# Altium schematic sheet [04] - LCD, VGA.SchDoc
size A3; CompanyName: FPT-FTI copporation; Address1: FPT Building Duy Tan; Address2: Floor 4,; DocumentNumber: 4; SheetNumber: 4; SheetTotal: 13; NameAuthor: Angle Vu
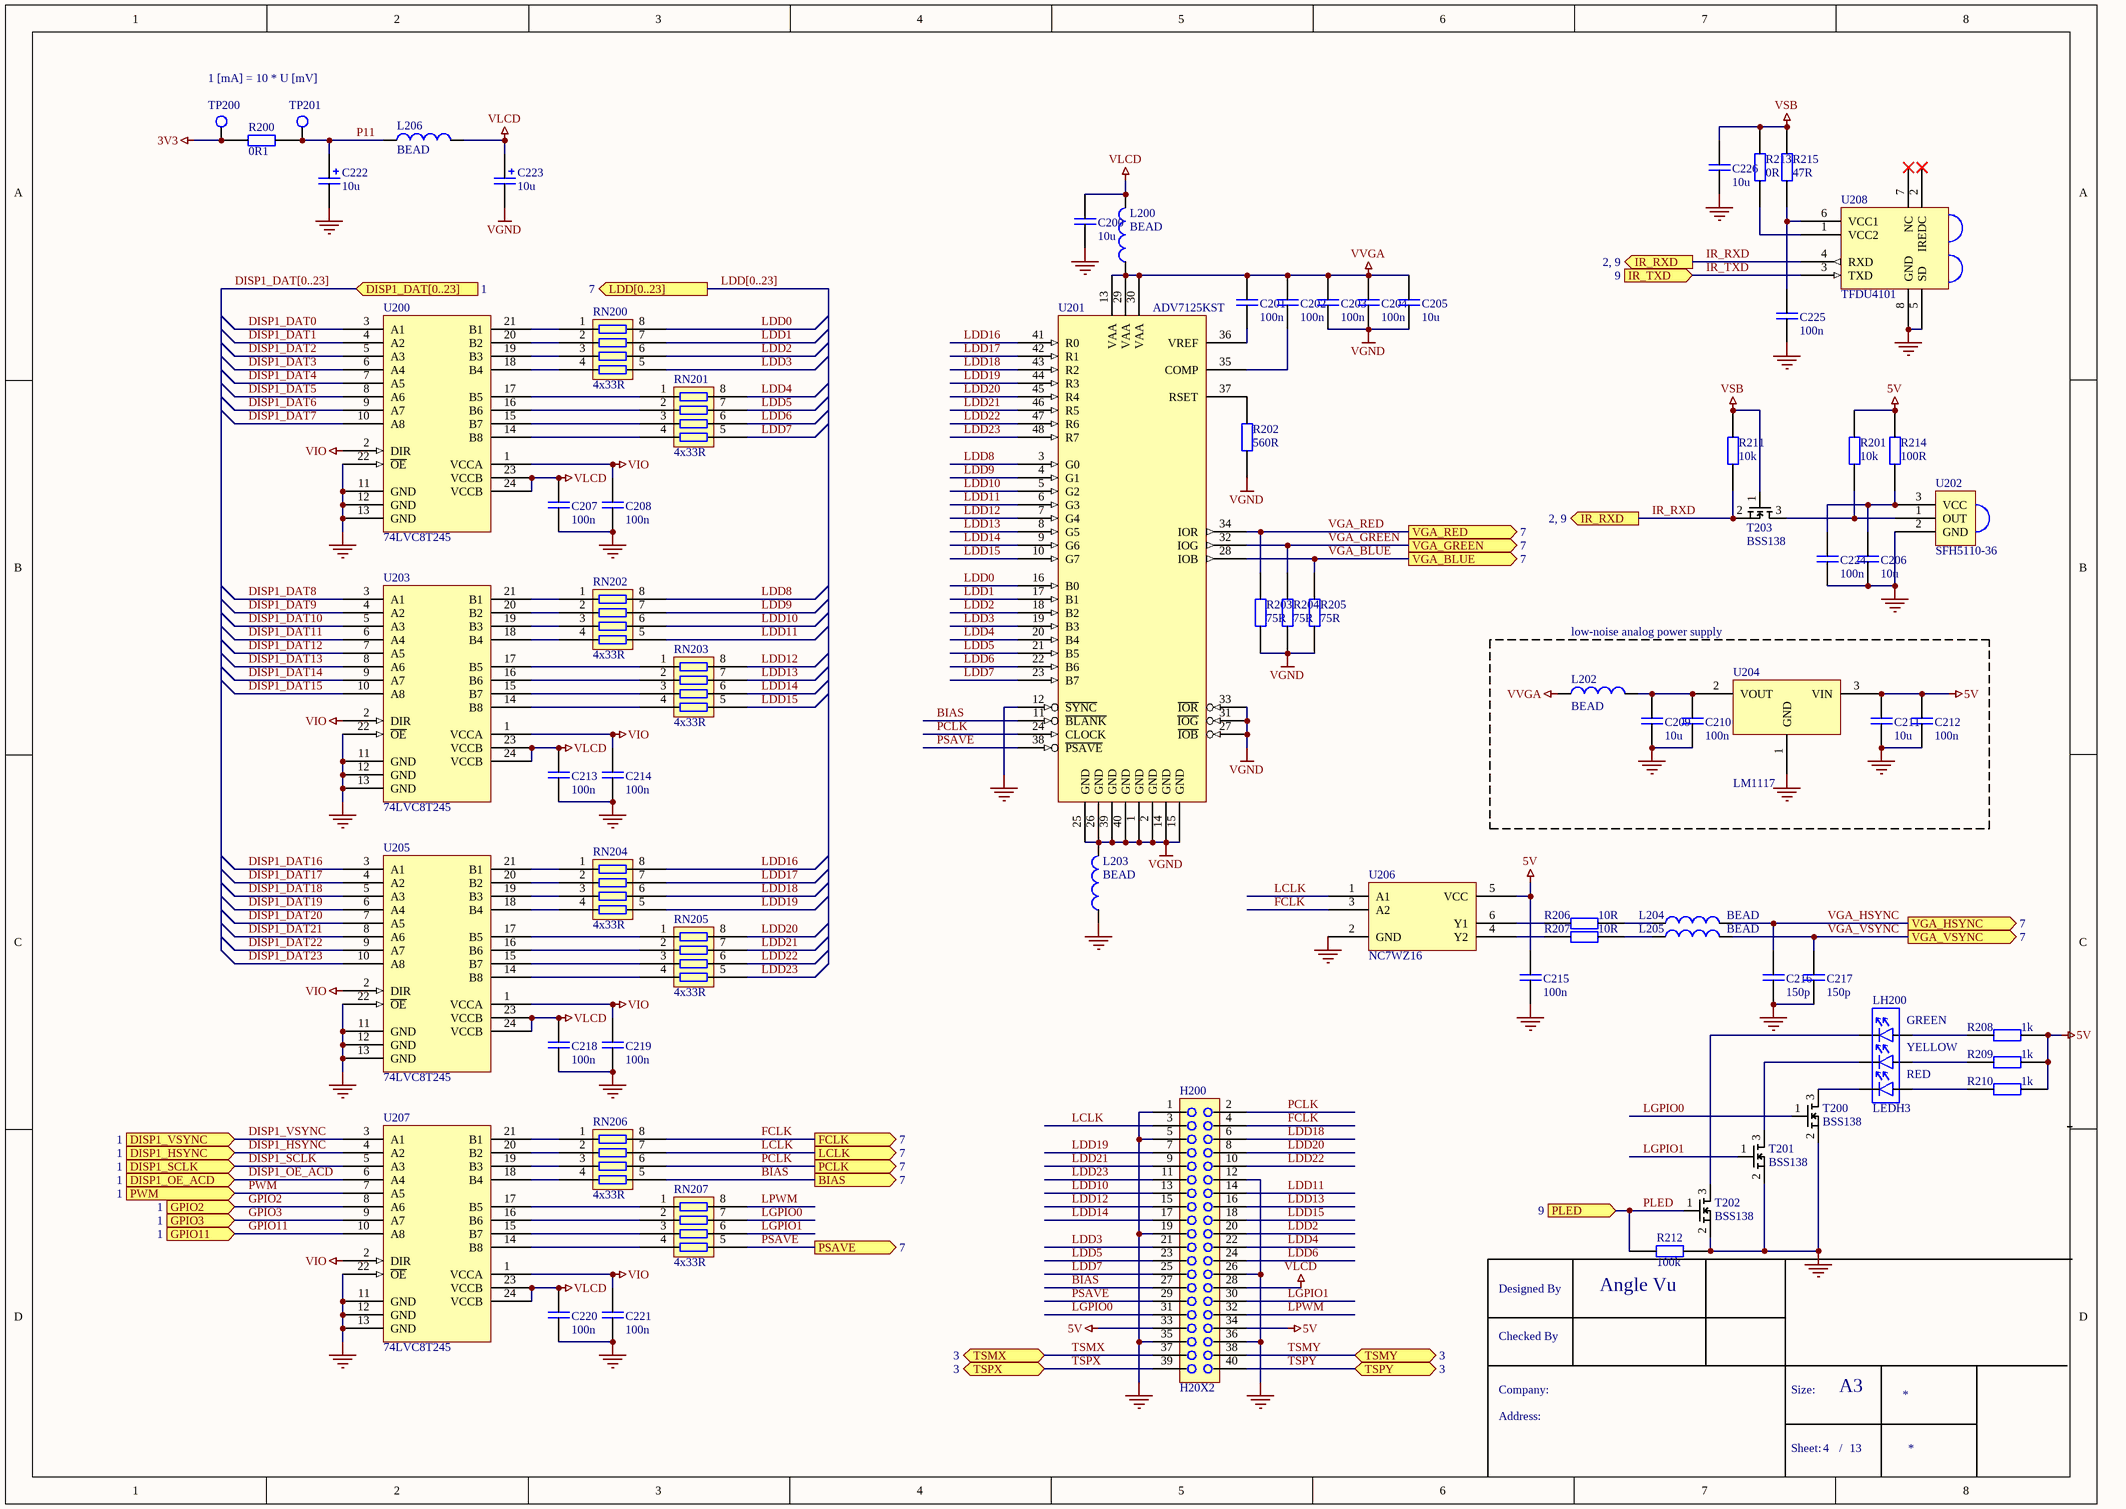
[diagram p0: [04] - LCD, VGA.SchDoc]

## Parts
C200  10u  [0805]
C201  100n  [0603]
C202  100n  [0603]
C203  100n  [0603]
C204  100n  [0603]
C205  10u  [0805]
C206  10u  [0805]
C207  100n  [0603]
C208  100n  [0603]
C209  10u  [0805]
C210  100n  [0603]
C211  10u  [0805]
C212  100n  [0603]
C213  100n  [0603]
C214  100n  [0603]
C215  100n  [0603]
C216  150p  [0603]
C217  150p  [0603]
C218  100n  [0603]
C219  100n  [0603]
C220  100n  [0603]
C221  100n  [0603]
C222  10u  [3216A]
C223  10u  [3216A]
C224  100n  [0603]
C225  100n  [0603]
C226  10u  [0805]
H200  H20X2  [H2x20]
L200  BEAD  [0603]
L202  BEAD  [0603]
L203  BEAD  [0603]
L204  BEAD  [0603]
L205  BEAD  [0603]
L206  BEAD  [0603]
LH200  LEDH3  [LED HOLDER 3]
R200  0R1  [0603]
R201  10k  [0603]
R202  560R  [0603]
R203  75R  [0603]
R204  75R  [0603]
R205  75R  [0603]
R206  10R  [0603]
R207  10R  [0603]
R208  1k  [0603]
R209  1k  [0603]
R210  1k  [0603]
R211  10k  [0603]
R212  100k  [0603]
R213  0R  [0603]
R214  100R  [0603]
R215  47R  [0603]
RN200  4x33R  [RX4_NS]
RN201  4x33R  [RX4_NS]
RN202  4x33R  [RX4_NS]
RN203  4x33R  [RX4_NS]
RN204  4x33R  [RX4_NS]
RN205  4x33R  [RX4_NS]
RN206  4x33R  [RX4_NS]
RN207  4x33R  [RX4_NS]
T200  BSS138  [SOT23]
T201  BSS138  [SOT23]
T202  BSS138  [SOT23]
T203  BSS138  [SOT23]
TP200  TESTPOINT  [TESTPOINT_2mm]  (value not drawn)
TP201  TESTPOINT  [TESTPOINT_2mm]  (value not drawn)
U200  74LVC8T245  [TSSOP24]
U201  ADV7125KST  [LQFP48]
U202  SFH5110-36  [SFH511x]
U203  74LVC8T245  [TSSOP24]
U204  LM1117  [SOT223]
U205  74LVC8T245  [TSSOP24]
U206  NC7WZ16  [SC70]
U207  74LVC8T245  [TSSOP24]
U208  TFDU4101  [TDFU4101]

## Blocks framed on the sheet
low-noise analog power supply: C209-C212 L202 U204

## Ports
BIAS (out, see 7), DISP1_DAT[0..23] (in, see 1), DISP1_HSYNC (in, see 1), DISP1_OE_ACD (in, see 1), DISP1_SCLK (in, see 1), DISP1_VSYNC (in, see 1), FCLK (out, see 7), GPIO2 (in, see 1), GPIO3 (in, see 1), GPIO11 (in, see 1), IR_RXD (out, see 2, 9), IR_TXD (in, see 9), LCLK (out, see 7), LDD[0..23] (out, see 7), PCLK (out, see 7), PLED (in, see 9), PSAVE (out, see 7), PWM (in, see 1), TSMX (see 3), TSMY (see 3), TSPX (see 3), TSPY (see 3), VGA_BLUE (out, see 7), VGA_GREEN (out, see 7), VGA_HSYNC (out, see 7), VGA_RED (out, see 7), VGA_VSYNC (out, see 7)

## Nets
3V3: R200.1 TP200.1
5V: C211.2 C212.2 C215.2 H200.33 H200.34 R201.1 R208.1 R209.1 R210.1 R214.1 U204.3(VIN) U206.5(VCC)
GND: C200.1 C206.1 C207.1 C208.1 C209.1 C210.1 C211.1 C212.1 C213.1 C214.1 C215.1 C216.1 C217.1 C218.1 C219.1 C220.1 C221.1 C222.2 C224.1 C225.1 C226.1 H200.1 H200.5 H200.12 H200.19 H200.26 H200.35 H200.36 L203.1 R212.2 T200.2(S) T201.2(S) T202.2(S) U200.11(GND) U200.12(GND) U200.13(GND) U200.22(~{OE}) U201.12(~{SYNC}) U202.2(GND) U203.11(GND) U203.12(GND) U203.13(GND) U203.22(~{OE}) U204.1(GND) U205.11(GND) U205.12(GND) U205.13(GND) U205.22(~{OE}) U206.2(GND) U207.11(GND) U207.12(GND) U207.13(GND) U207.22(~{OE}) U208.5(SD) U208.8(GND)
VGND: C203.1 C204.1 C205.1 C223.2 L203.2 R202.1 R203.1 R204.1 R205.1 U201.1(GND) U201.2(GND) U201.14(GND) U201.15(GND) U201.25(GND) U201.26(GND) U201.27(~{IOB}) U201.31(~{IOG}) U201.33(~{IOR}) U201.39(GND) U201.40(GND)
VIO: C208.2 C214.2 C219.2 C221.2 U200.1(VCCA) U200.2(DIR) U203.1(VCCA) U203.2(DIR) U205.1(VCCA) U205.2(DIR) U207.1(VCCA) U207.2(DIR)
VLCD: C200.2 C207.2 C213.2 C218.2 C220.2 C223.1 H200.28 L200.2 L206.1 U200.23(VCCB) U200.24(VCCB) U203.23(VCCB) U203.24(VCCB) U205.23(VCCB) U205.24(VCCB) U207.23(VCCB) U207.24(VCCB)
VSB: C226.2 R211.1 R213.2 R215.1 T203.1(G)
VVGA: C201.2 C202.2 C203.2 C204.2 C205.2 L200.1 L202.1 U201.13(VAA) U201.29(VAA) U201.30(VAA)
BIAS: H200.27 RN206.5 U201.11(~{BLANK}) ; port BIAS
DISP1_DAT0: U200.3(A1)
DISP1_DAT1: U200.4(A2)
DISP1_DAT2: U200.5(A3)
DISP1_DAT3: U200.6(A4)
DISP1_DAT4: U200.7(A5)
DISP1_DAT5: U200.8(A6)
DISP1_DAT6: U200.9(A7)
DISP1_DAT7: U200.10(A8)
DISP1_DAT8: U203.3(A1)
DISP1_DAT9: U203.4(A2)
DISP1_DAT10: U203.5(A3)
DISP1_DAT11: U203.6(A4)
DISP1_DAT12: U203.7(A5)
DISP1_DAT13: U203.8(A6)
DISP1_DAT14: U203.9(A7)
DISP1_DAT15: U203.10(A8)
DISP1_DAT16: U205.3(A1)
DISP1_DAT17: U205.4(A2)
DISP1_DAT18: U205.5(A3)
DISP1_DAT19: U205.6(A4)
DISP1_DAT20: U205.7(A5)
DISP1_DAT21: U205.8(A6)
DISP1_DAT22: U205.9(A7)
DISP1_DAT23: U205.10(A8)
DISP1_HSYNC: U207.4(A2) ; port DISP1_HSYNC
DISP1_OE_ACD: U207.6(A4) ; port DISP1_OE_ACD
DISP1_SCLK: U207.5(A3) ; port DISP1_SCLK
DISP1_VSYNC: U207.3(A1) ; port DISP1_VSYNC
FCLK: H200.4 RN206.8 U206.3(A2) ; port FCLK
GPIO2: U207.8(A6) ; port GPIO2
GPIO3: U207.9(A7) ; port GPIO3
GPIO11: U207.10(A8) ; port GPIO11
IR_RXD: R211.2 T203.2(S) U208.4(RXD) ; port IR_RXD
IR_TXD: U208.3(TXD) ; port IR_TXD
LCLK: H200.3 RN206.7 U206.1(A1) ; port LCLK
LDD0: RN200.8 U201.16(B0)
LDD1: RN200.7 U201.17(B1)
LDD2: H200.20 RN200.6 U201.18(B2)
LDD3: H200.21 RN200.5 U201.19(B3)
LDD4: H200.22 RN201.8 U201.20(B4)
LDD5: H200.23 RN201.7 U201.21(B5)
LDD6: H200.24 RN201.6 U201.22(B6)
LDD7: H200.25 RN201.5 U201.23(B7)
LDD8: RN202.8 U201.3(G0)
LDD9: RN202.7 U201.4(G1)
LDD10: H200.13 RN202.6 U201.5(G2)
LDD11: H200.14 RN202.5 U201.6(G3)
LDD12: H200.15 RN203.8 U201.7(G4)
LDD13: H200.16 RN203.7 U201.8(G5)
LDD14: H200.17 RN203.6 U201.9(G6)
LDD15: H200.18 RN203.5 U201.10(G7)
LDD16: RN204.8 U201.41(R0)
LDD17: RN204.7 U201.42(R1)
LDD18: H200.6 RN204.6 U201.43(R2)
LDD19: H200.7 RN204.5 U201.44(R3)
LDD20: H200.8 RN205.8 U201.45(R4)
LDD21: H200.9 RN205.7 U201.46(R5)
LDD22: H200.10 RN205.6 U201.47(R6)
LDD23: H200.11 RN205.5 U201.48(R7)
LGPIO0: H200.31 RN207.7 T200.1(G)
LGPIO1: H200.30 RN207.6 T201.1(G)
LPWM: H200.32 RN207.8
P11: C222.1 L206.2 R200.2 TP201.1
PCLK: H200.2 RN206.6 U201.24(CLOCK) ; port PCLK
PLED: R212.1 T202.1(G) ; port PLED
PSAVE: H200.29 RN207.5 U201.38(~{PSAVE}) ; port PSAVE
PWM: U207.7(A5) ; port PWM
TSMX: H200.37 ; port TSMX
TSMY: H200.38 ; port TSMY
TSPX: H200.39 ; port TSPX
TSPY: H200.40 ; port TSPY
VGA_BLUE: R205.2 U201.28(IOB) ; port VGA_BLUE
VGA_GREEN: R204.2 U201.32(IOG) ; port VGA_GREEN
VGA_HSYNC: C216.2 L204.2 ; port VGA_HSYNC
VGA_RED: R203.2 U201.34(IOR) ; port VGA_RED
VGA_VSYNC: C217.2 L205.2 ; port VGA_VSYNC
NetC201_1: C201.1 U201.36(VREF)
NetC202_1: C202.1 U201.35(COMP)
NetC206_2: C206.2 C224.2 R214.2 U202.3(VCC)
NetC209_2: C209.2 C210.2 L202.2 U204.2(VOUT)
NetC225_2: C225.2 R215.2 U208.6(VCC1)
NetL204_1: L204.1 R206.1
NetL205_1: L205.1 R207.1
NetLH200_1: LH200.1 T202.3(D)
NetLH200_2: LH200.2 R208.2
NetLH200_3: LH200.3 T201.3(D)
NetLH200_4: LH200.4 R209.2
NetLH200_5: LH200.5 T200.3(D)
NetLH200_6: LH200.6 R210.2
NetR201_2: R201.2 T203.3(D) U202.1(OUT)
NetR202_2: R202.2 U201.37(RSET)
NetR206_2: R206.2 U206.6(Y1)
NetR207_2: R207.2 U206.4(Y2)
NetR213_1: R213.1 U208.1(VCC2)
NetRN200_1: RN200.1 U200.21(B1)
NetRN200_2: RN200.2 U200.20(B2)
NetRN200_3: RN200.3 U200.19(B3)
NetRN200_4: RN200.4 U200.18(B4)
NetRN201_1: RN201.1 U200.17(B5)
NetRN201_2: RN201.2 U200.16(B6)
NetRN201_3: RN201.3 U200.15(B7)
NetRN201_4: RN201.4 U200.14(B8)
NetRN202_1: RN202.1 U203.21(B1)
NetRN202_2: RN202.2 U203.20(B2)
NetRN202_3: RN202.3 U203.19(B3)
NetRN202_4: RN202.4 U203.18(B4)
NetRN203_1: RN203.1 U203.17(B5)
NetRN203_2: RN203.2 U203.16(B6)
NetRN203_3: RN203.3 U203.15(B7)
NetRN203_4: RN203.4 U203.14(B8)
NetRN204_1: RN204.1 U205.21(B1)
NetRN204_2: RN204.2 U205.20(B2)
NetRN204_3: RN204.3 U205.19(B3)
NetRN204_4: RN204.4 U205.18(B4)
NetRN205_1: RN205.1 U205.17(B5)
NetRN205_2: RN205.2 U205.16(B6)
NetRN205_3: RN205.3 U205.15(B7)
NetRN205_4: RN205.4 U205.14(B8)
NetRN206_1: RN206.1 U207.21(B1)
NetRN206_2: RN206.2 U207.20(B2)
NetRN206_3: RN206.3 U207.19(B3)
NetRN206_4: RN206.4 U207.18(B4)
NetRN207_1: RN207.1 U207.17(B5)
NetRN207_2: RN207.2 U207.16(B6)
NetRN207_3: RN207.3 U207.15(B7)
NetRN207_4: RN207.4 U207.14(B8)

Not connected (* = marked no-connect by the designer): U208 2(IREDC)* 7(NC)*

## Buses and harness runs
bus DISP1_DAT[0..23] = port DISP1_DAT[0..23]
bus LDD[0..23] = port LDD[0..23]

## Notes on the sheet
- 1 [mA] = 10 * U [mV]
- Designed By
- Checked By
- Company:
- Size:
- A3
- Address:
- Sheet:
- /
- (in symbol LEDH3) GREEN; YELLOW; RED

## Library data of the parts
C200-C221 C224-C226 = C
C222 C223 = C+
L200 L202-L206 = FBEAD
R200-R215 = R
RN200-RN207 = RN4
TP200 TP201 = TESTPOINT: Testpoint pad; Order number: no component; Component class: TP; Producer: n/a; Assembly type: no component
U201 = ADV7125
U202 = SFH5110